# Altium schematic sheet USB_SERIAL.SchDoc
size A4; DocumentNumber: 6; SheetNumber: 6; SheetTotal: 11
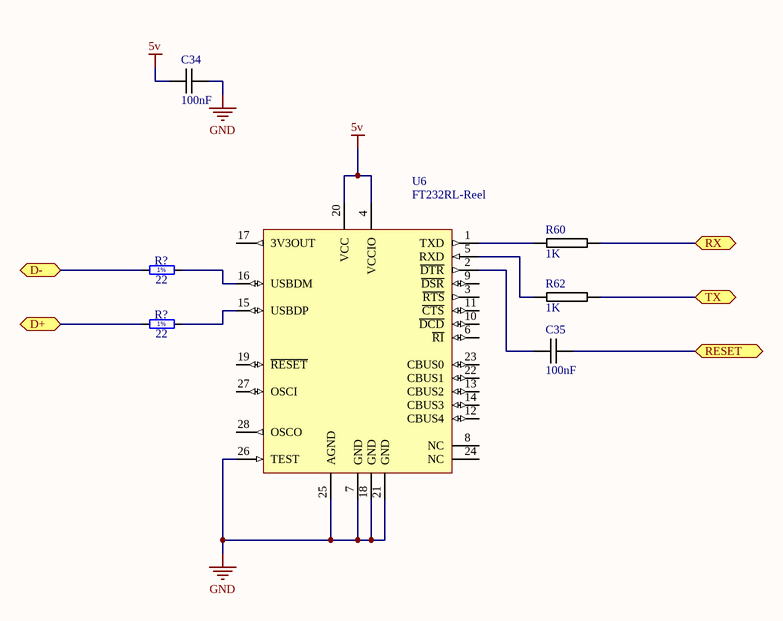
[diagram p0: USB_SERIAL.SchDoc]

## Parts
(Parts that share a designator on the sheet are numbered #1, #2 ... from top to bottom, then left to right.)
C34  100nF  [0805C-TBD]
C35  100nF  [0805C-TBD]
R60  1K  [0805R-1K]
R62  1K  [0805R-1K]
R?#1  22  [RESC2012X60N]
R?#2  22  [RESC2012X60N]
U6  FT232RL-Reel  [SSOP-28_N]

## Ports
D+, D-, RESET, RX, TX

## Nets
5v: C34.1 U6.4(VCCIO) U6.20(VCC)
GND: C34.2 U6.7(GND) U6.18(GND) U6.21(GND) U6.25(AGND) U6.26(TEST)
D+: R?#2.1 ; port D+
D-: R?#1.1 ; port D-
RESET: C35.2 ; port RESET
RX: R60.2 ; port RX
TX: R62.2 ; port TX
NetC35_1: C35.1 U6.2(~{DTR})
NetR60_1: R60.1 U6.1(TXD)
NetR62_1: R62.1 U6.5(RXD)
NetR?#1_2: R?#1.2 U6.16(USBDM)
NetR?#2_2: R?#2.2 U6.15(USBDP)

Not connected (* = marked no-connect by the designer): U6 3(~{RTS}) 6(~{RI}) 8(NC) 9(~{DSR}) 10(~{DCD}) 11(~{CTS}) 12(CBUS4) 13(CBUS2) 14(CBUS3) 17(3V3OUT) 19(~{RESET}) 22(CBUS1) 23(CBUS0) 24(NC) 27(OSCI) 28(OSCO)

## Notes on the sheet
- (in symbol R0805_22R_1%_0.125W_100PPM) 1%

## Library data of the parts
C34 C35 = 0805C-100nF-25V-X7R-MUR: CAPACITOR 0805 CERAMIC; Supplier 1: Digi-Key; Supplier Part Number 1: 490-1673-1-ND
R60 R62 = 0805R-1K: RESISTOR 0805 1/4 WATT THIN FILM; Reel: *
R?#1 R?#2 = R0805_22R_1%_0.125W_100PPM: Resistor - 1%; Part Description: General Purpose Thick Film Chip Resistor; Manufacturer: GENERIC; Manufacturer1 Part Number: NRC10F22R0TRF; Power: 0.125W; TC: ±100ppm/°C; Table: Resistors SMD; Part Number: R0805_22R_1%_0.125W_100PPM; Component Kind: Standard; Component Type: Standard; Pin Count: 2; Value: 22; Status: Preferred; Tolerance: ±1%; Manufacturer Part Number: R0805_22R_1%_0.125W_100PPM; Case: 0805; Mounted: Yes; Socket: No; SMD: Yes; Manufacturer1 Example: NIC COMPONENT; Manufacturer1 ComponentHeight: 0.6mm; HelpURL: \\cern.ch\dfs\Applications\Altium\Datasheets\R0805_NIC_NRC.pdf; Author: CERN DEM JLC; CreateDate: 03/12/2007; LatestRevisionDate: 13/03/2008
U6 = FT232RL-Reel: USB UART Asynchronous Serial Data Transfer Chip, 28-pin SSOP, Tape and Reel; Manufacturer: FTDI; DatasheetVersion: ver 2.10, Mar-2012; PackageVersion: Mar-12; PackageReference: SSOP-28; PackageDescription: 28-Pin Small Outline Package 0.65 mm Pitch; PartNumber: FT232RL-Reel; ComponentLink1Description: Manufacturer URL; ComponentLink1URL: http://www.ftdichip.com/; ComponentLink2Description: Datasheet; ComponentLink2URL: http://www.ftdichip.com/Support/Documents/DataSheets/ICs/DS_FT232R.pdf